# Altium schematic sheet DDMTD.SchDoc: Sayma AMC
size 420 x 297 mm; CheckedBy: P.Kulik,T.Przywozki,W.Ruclo; Author: G.Kasprowicz; CompanyName: WUT ISE; DrawnBy: G.Kasprowicz; Organization: WUT ISE; Address1: PW ISE; Address2: Nowowiejska 15/19 00-665 Warsaw; Address3: gkasprow@gmail.com; DocumentNumber: 18; Revision: 2; SheetNumber: 18; SheetTotal: 32; ModifiedBy: -; CheckedDate: -; Title2: WR DDMTD; DivGrp: WUT ISE; Designer: G.Kasprowicz; ModifiedDate: -; ProjectName: Sensor Box
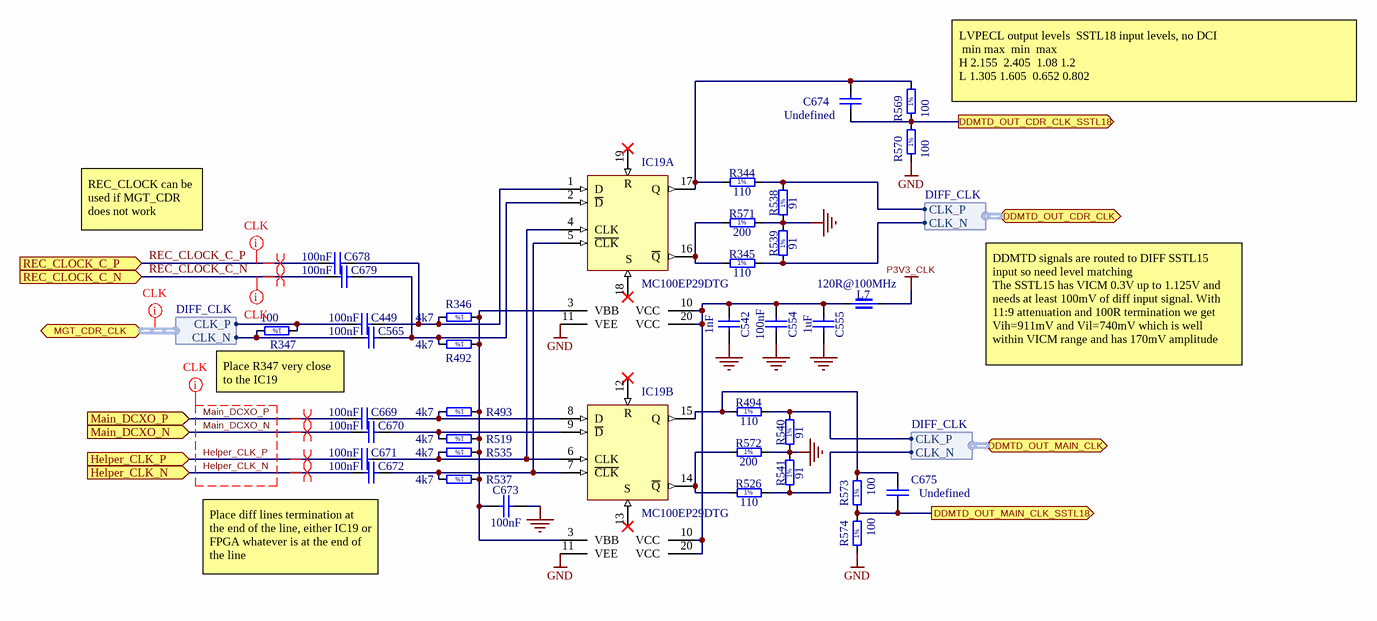
[diagram p0: DDMTD.SchDoc]

## Parts
C449  100nF  [CAPC1005X55N]
C542  1nF  [CAPC0603X33N]
C554  100nF  [CAPC0603X33N]
C555  1uF  [CAPC1005X55N]
C565  100nF  [CAPC1005X55N]
C669  100nF  [CAPC1005X55N]
C670  100nF  [CAPC1005X55N]
C671  100nF  [CAPC1005X55N]
C672  100nF  [CAPC1005X55N]
C673  100nF  [CAPC0603X33N]
C674  Undefined  [CAPC1005X55N]
C675  Undefined  [CAPC1005X55N]
C678  100nF  [CAPC1005X55N]
C679  100nF  [CAPC1005X55N]
IC19  MC100EP29DTG  [SOP65P640X120-20N]  (parts A,B of 2)
L7  120R@100MHz  [INDC1608X95N]
R344  110  [RESC1005X40N]
R345  110  [RESC1005X40N]
R346  4k7  [RESC1005X40N]
R347  100  [RESC1005X40N]
R492  4k7  [RESC1005X40N]
R493  4k7  [RESC1005X40N]
R494  110  [RESC1005X40N]
R519  4k7  [RESC1005X40N]
R526  110  [RESC1005X40N]
R535  4k7  [RESC1005X40N]
R537  4k7  [RESC1005X40N]
R538  91  [RESC1005X40N]
R539  91  [RESC1005X40N]
R540  91  [RESC1005X40N]
R541  91  [RESC1005X40N]
R569  100  [RESC1005X40N]
R570  100  [RESC1005X40N]
R571  200  [RESC1005X40N]
R572  200  [RESC1005X40N]
R573  100  [RESC1005X40N]
R574  100  [RESC1005X40N]

## Ports
DDMTD_OUT_CDR_CLK (bidir, harness DIFF_CLK), DDMTD_OUT_CDR_CLK_SSTL18 (out), DDMTD_OUT_MAIN_CLK (bidir, harness DIFF_CLK), DDMTD_OUT_MAIN_CLK_SSTL18 (out), Helper_CLK_N (in), Helper_CLK_P (in), Main_DCXO_N (in), Main_DCXO_P (in), MGT_CDR_CLK (bidir, harness DIFF_CLK), REC_CLOCK_C_N (in), REC_CLOCK_C_P (in)

## Harnesses
DIFF_CLK: CLK_N, CLK_P

## Nets
GND: C542.1 C554.1 C555.2 C673.1 IC19.11(VEE) R538.1 R539.2 R540.1 R541.2 R570.1 R571.2 R572.2 R574.1
P3V3_CLK: L7.1
DDMTD_OUT_CDR_CLK_SSTL18: C674.1 R569.1 R570.2 ; port DDMTD_OUT_CDR_CLK_SSTL18
DDMTD_OUT_MAIN_CLK_SSTL18: C675.1 R573.1 R574.2 ; port DDMTD_OUT_MAIN_CLK_SSTL18
Helper_CLK_N: C672.1 ; port Helper_CLK_N
Helper_CLK_P: C671.1 ; port Helper_CLK_P
Main_DCXO_N: C670.1 ; port Main_DCXO_N
Main_DCXO_P: C669.1 ; port Main_DCXO_P
REC_CLOCK_C_N: C679.1 ; port REC_CLOCK_C_N
REC_CLOCK_C_P: C678.1 ; port REC_CLOCK_C_P
NetC449_1: C449.1 R347.1 ; port MGT_CDR_CLK.CLK_P
NetC449_2: C449.2 C678.2 IC19.1(D) R346.2
NetC542_2: C542.2 C554.2 C555.1 IC19.10(VCC) IC19.20(VCC) L7.2
NetC565_1: C565.1 R347.2 ; port MGT_CDR_CLK.CLK_N
NetC565_2: C565.2 C679.2 IC19.2(~{D}) R492.2
NetC669_2: C669.2 IC19.8(D) R493.2
NetC670_2: C670.2 IC19.9(~{D}) R519.2
NetC671_2: C671.2 IC19.4(CLK) IC19.6(CLK) R535.2
NetC672_2: C672.2 IC19.5(~{CLK}) IC19.7(~{CLK}) R537.2
NetC673_2: C673.2 IC19.3(VBB) R346.1 R492.1 R493.1 R519.1 R535.1 R537.1
NetC674_2: C674.2 IC19.17(Q) R344.1 R569.2
NetC675_2: C675.2 IC19.15(Q) R494.1 R573.2
NetIC19_14: IC19.14(~{Q}) R526.1 R572.1
NetIC19_16: IC19.16(~{Q}) R345.1 R571.1
NetR344_2: R344.2 R538.2 ; port DDMTD_OUT_CDR_CLK.CLK_P
NetR345_2: R345.2 R539.1 ; port DDMTD_OUT_CDR_CLK.CLK_N
NetR494_2: R494.2 R540.2 ; port DDMTD_OUT_MAIN_CLK.CLK_P
NetR526_2: R526.2 R541.1 ; port DDMTD_OUT_MAIN_CLK.CLK_N

Not connected (* = marked no-connect by the designer): IC19 12(R)* 13(S)* 18(S)* 19(R)*

## Layout directives
differential pair: Helper_CLK_N, Helper_CLK_P, Main_DCXO_N, Main_DCXO_P, REC_CLOCK_C_N, REC_CLOCK_C_P
net class CLK: (no net found under the mark), Helper_CLK_N, Helper_CLK_P, Main_DCXO_N, Main_DCXO_P, REC_CLOCK_C_N, REC_CLOCK_C_P

## Notes on the sheet
- LVPECL output levels		SSTL18 input levels, no DCI
  min	max		min	 max
  H	2.155 	2.405		1.08	1.2
  L	1.305	1.605		0.652	0.802
- REC_CLOCK can be used if MGT_CDR does not work
- DDMTD signals are routed to DIFF SSTL15 input so need level matching
  The SSTL15 has VICM 0.3V up to 1.125V and needs at least 100mV of diff input signal. With 11:9 attenuation and 100R termination we get Vih=911mV and Vil=740mV which is well within VICM range and has 170mV amplitude
- Place R347 very close  to the IC19
- Place diff lines termination at the end of the line, either IC19 or FPGA whatever is at the end of the line
- Project/Equipment
- Document
- Designer
- Drawn by
- Check.by
- Copyright WUT ISE 2018.
  This documentation describes Open Hardware and is licensed under the CERN OHL v.1.1. You may redistribute and modify this documentation under the terms of the CERN OHL v.1.1. (http://ohwr.org/CERNOHL). This documentation is distributed WITHOUT ANY EXPRESS OR IMPLIED WARRANTY, INCLUDING OF MERCHANTABILITY, SATISFACTORY QUALITY AND FITNESS FOR A PARTICULAR PURPOSE. Please see the CERN OHL v.1.1 for applicable conditions.
- Contact
- File
- Last Mod.
- Print Date
- Sheet
- Size
- A3
- of
- Rev
- (in symbol R0402_4K7_1%_0.0625W_100PPM) 1%
- (in symbol R0402_91R_1%_0.0625W_100PPM) 1%
- (in symbol R0402_100R_1%_0.0625W_100PPM) 1%
- (in symbol R0402_110R_1%_0.0625W_100PPM) 1%
- (in symbol R0402_200R_1%_0.0625W_100PPM) 1%

## Library data of the parts
C449 C565 C669-C672 C678 C679 = CC0402_100NF_16V_10%_X5R: Non-polarised capacitor; Manufacturer: GENERIC; Manufacturer1 Part Number: GRM155R61C104KA88D; Part Description: SMD Multilayer Chip Ceramic Capacitor; TC: X5R; Tolerance: ±10%; Voltage: 16V; Case: 0402; Manufacturer Part Number: CC0402_100NF_16V_10%_X5R; Manufacturer1 Example: MURATA; Part Number: CC0402_100NF_16V_10%_X5R; Pin Count: 2; SMD: Yes; Status: None; Value: 100nF; Component Kind: Standard; Component Type: Standard; Mounted: Yes; Socket: No; Sense: No; Manufacturer1 ComponentHeight: 0.55mm; HelpURL: \\cern.ch\dfs\Applications\Altium\Datasheets\CC0402_X5R_MURATA_GRM.pdf; Author: CERN DEM JLC; CreateDate: 10.12.2013; LatestRevisionDate: 10.12.2013
C542 = CC0201_1NF_16V_10%_X5R: Non-polarised capacitor; Manufacturer: GENERIC; Part Description: SMD Multilayer Chip Ceramic Capacitor; Manufacturer1 Part Number: 0201YD102KAT2A; Tolerance: ±10%; Voltage: 16V; TC: X5R; Manufacturer Part Number: CC0201_1NF_16V_10%_X5R; Part Number: CC0201_1NF_16V_10%_X5R; Value: 1nF; Component Kind: Standard; Component Type: Standard; Pin Count: 2; Status: Not Recommended; Case: 0201; Mounted: Yes; Socket: No; SMD: Yes; Sense: No; Manufacturer1 Example: AVX; Manufacturer1 ComponentHeight: 0.33mm; HelpURL: \\cern.ch\dfs\Applications\Altium\Datasheets\CC0201_X5R_AVX.pdf; Author: CERN DEM JLC; CreateDate: 03.12.2007; LatestRevisionDate: 03.12.2007
C554 C673 = CC0201_100NF_6.3V_10%_X5R: Non-polarised capacitor; Manufacturer: GENERIC; Part Description: SMD Multilayer Chip Ceramic Capacitor; Manufacturer1 Part Number: 02016D104KAT2A; Tolerance: ±10%; Voltage: 6.3V; TC: X5R; Manufacturer Part Number: CC0201_100NF_6.3V_10%_X5R; Part Number: CC0201_100NF_6.3V_10%_X5R; Value: 100nF; Component Kind: Standard; Component Type: Standard; Pin Count: 2; Status: Not Recommended; Case: 0201; Mounted: Yes; Socket: No; SMD: Yes; Sense: No; Manufacturer1 Example: AVX; Manufacturer1 ComponentHeight: 0.33mm; HelpURL: \\cern.ch\dfs\Applications\Altium\Datasheets\CC0201_X5R_AVX.pdf; Author: CERN DEM JLC; CreateDate: 03.12.2007; LatestRevisionDate: 03.12.2007
C555 = CC0402_1UF_16V_10%_X5R: Non-polarised capacitor; Manufacturer: GENERIC; Part Description: SMD Multilayer Chip Ceramic Capacitor; Manufacturer1 Part Number: C1005X5R1C105KT; Tolerance: ±10%; Voltage: 16V; TC: X5R; Manufacturer Part Number: CC0402_1UF_16V_10%_X5R; Part Number: CC0402_1UF_16V_10%_X5R; Value: 1uF; Component Kind: Standard; Component Type: Standard; Pin Count: 2; Status: Preferred; Case: 0402; Mounted: Yes; Socket: No; SMD: Yes; Sense: No; Manufacturer1 Example: TDK; Manufacturer1 ComponentHeight: 0.55mm; HelpURL: \\cern.ch\dfs\Applications\Altium\Datasheets\CC0402_X5R_TDK_C.pdf; Author: CERN DEM JLC; CreateDate: 25.10.2012; LatestRevisionDate: 25.10.2012
C674 C675 = CC0402_NO-VALUE: Non-polarised capacitor; Part Description: Reserved Footprint For 0402(1005) Chip Ceramic Capacitor; Mounted: No; Part Number: CC0402_NO-VALUE; Component Kind: Standard; Component Type: Standard; Pin Count: 2; Value: Undefined; Status: None; Manufacturer: Undefined; Manufacturer Part Number: CC0402_NO-VALUE; Case: 0402; Socket: No; SMD: Yes; Sense: No; Manufacturer1 ComponentHeight: 0.55mm; HelpURL: Undefined; Author: CERN DEM JLC; CreateDate: 14.01.2014; LatestRevisionDate: 14.01.2014
IC19 = MC100EP29DTG: 3.3V/5V ECL Dual Differential Data and Clock D Flip-Flop With Set and Reset; Manufacturer: ON SEMICONDUCTOR; PressFit: No; Bonding: No; Part Number: MC100EP29DTG; Component Kind: Standard; Component Type: Standard; Device: MC100EP29DTG; PackageDescription: SOP, 20-Leads, Body 6.5x4.4mm, Pitch 0.65mm, IPC Medium Density; Part Description: 3.3V/5V ECL Dual Differential Data And Clock D Flip-Flop With Set and Reset; Manufacturer Part Number: MC100EP29DTG; Pin Count: 20; Case: TSSOP20; Mounted: Yes; Socket: No; SMD: Yes; Sense: No; ComponentHeight: 1.2mm; Author: CERN DEM JLC; HelpURL: \\cern.ch\dfs\Applications\Altium\Datasheets\MC100EP29DTG.pdf; CreateDate: 12.01.2011; LatestRevisionDate: 12.01.2011
L7 = IND0603_MURATA_BLM18PG121SN1D: Manufacturer: MURATA; Part Description: SMD EMIFIL Chip Ferrite Bead; Power: 2A; Resistance: 0.05R; Manufacturer Part Number: BLM18PG121SN1D; Part Number: IND0603_MURATA_BLM18PG121SN1D; Value: 120R@100MHz; Component Kind: Standard; Component Type: Standard; Pin Count: 2; Status: None; Case: 0603; Mounted: Yes; Socket: No; SMD: Yes; Sense: No; ComponentHeight: 0.95mm; HelpURL: \\cern.ch\dfs\Applications\Altium\Datasheets\IND0603_MURATA_BLM18P.pdf; Author: CERN DEM BC; CreateDate: 27.07.2015; LatestRevisionDate: 25.10.2018
R344 R345 R494 R526 = R0402_110R_1%_0.0625W_100PPM: Resistor - 1%; Manufacturer: GENERIC; Part Description: General Purpose Thick Film Chip Resistor; Manufacturer1 Part Number: 232270671101L; TC: ±100ppm/°C; PressFit: No; Manufacturer Part Number: R0402_110R_1%_0.0625W_100PPM; Part Number: R0402_110R_1%_0.0625W_100PPM; Tolerance: ±1%; Value: 110; Component Kind: Standard; Component Type: Standard; Pin Count: 2; Status: Not Recommended; Power: 0.0625W; Case: 0402; Mounted: Yes; Sense: No; Socket: No; SMD: Yes; Manufacturer1 Example: YAGEO PHYCOMP; Manufacturer1 ComponentHeight: 0.4mm; HelpURL: \\cern.ch\dfs\Applications\Altium\Datasheets\R0402_Phycomp_RC0402.pdf; Author: CERN DEM JLC; CreateDate: 03.12.2007; LatestRevisionDate: 17.10.2012
R346 R492 R493 R519 R535 R537 = R0402_4K7_1%_0.0625W_100PPM: Resistor - 1%; Manufacturer: GENERIC; Part Description: General Purpose Thick Film Chip Resistor; Manufacturer1 Part Number: 232270674702L; TC: ±100ppm/°C; PressFit: No; Manufacturer Part Number: R0402_4K7_1%_0.0625W_100PPM; Part Number: R0402_4K7_1%_0.0625W_100PPM; Tolerance: ±1%; Value: 4k7; Component Kind: Standard; Component Type: Standard; Pin Count: 2; Status: Not Recommended; Power: 0.0625W; Case: 0402; Mounted: Yes; Sense: No; Socket: No; SMD: Yes; Manufacturer1 Example: YAGEO PHYCOMP; Manufacturer1 ComponentHeight: 0.4mm; HelpURL: \\cern.ch\dfs\Applications\Altium\Datasheets\R0402_Phycomp_RC0402.pdf; Author: CERN DEM JLC; CreateDate: 03.12.2007; LatestRevisionDate: 17.10.2012
R347 R569 R570 R573 R574 = R0402_100R_1%_0.0625W_100PPM: Resistor - 1%; Manufacturer: GENERIC; Part Description: General Purpose Thick Film Chip Resistor; Manufacturer1 Part Number: 232270671001L; TC: ±100ppm/°C; PressFit: No; Manufacturer Part Number: R0402_100R_1%_0.0625W_100PPM; Part Number: R0402_100R_1%_0.0625W_100PPM; Tolerance: ±1%; Value: 100; Component Kind: Standard; Component Type: Standard; Pin Count: 2; Status: Not Recommended; Power: 0.0625W; Case: 0402; Mounted: Yes; Sense: No; Socket: No; SMD: Yes; Manufacturer1 Example: YAGEO PHYCOMP; Manufacturer1 ComponentHeight: 0.4mm; HelpURL: \\cern.ch\dfs\Applications\Altium\Datasheets\R0402_Phycomp_RC0402.pdf; Author: CERN DEM JLC; CreateDate: 03.12.2007; LatestRevisionDate: 17.10.2012
R538-R541 = R0402_91R_1%_0.0625W_100PPM: Resistor - 1%; Manufacturer: GENERIC; Part Description: General Purpose Thick Film Chip Resistor; Manufacturer1 Part Number: 232270679109L; TC: ±100ppm/°C; PressFit: No; Manufacturer Part Number: R0402_91R_1%_0.0625W_100PPM; Part Number: R0402_91R_1%_0.0625W_100PPM; Tolerance: ±1%; Value: 91; Component Kind: Standard; Component Type: Standard; Pin Count: 2; Status: Not Recommended; Power: 0.0625W; Case: 0402; Mounted: Yes; Sense: No; Socket: No; SMD: Yes; Manufacturer1 Example: YAGEO PHYCOMP; Manufacturer1 ComponentHeight: 0.4mm; HelpURL: \\cern.ch\dfs\Applications\Altium\Datasheets\R0402_Phycomp_RC0402.pdf; Author: CERN DEM JLC; CreateDate: 03.12.2007; LatestRevisionDate: 17.10.2012
R571 R572 = R0402_200R_1%_0.0625W_100PPM: Resistor - 1%; Part Description: General Purpose Thick Film Chip Resistor; Manufacturer: GENERIC; Manufacturer1 Part Number: 232270672001L; TC: ±100ppm/°C; PressFit: No; Part Number: R0402_200R_1%_0.0625W_100PPM; Component Kind: Standard; Component Type: Standard; Pin Count: 2; Value: 200; Status: Not Recommended; Power: 0.0625W; Tolerance: ±1%; Manufacturer Part Number: R0402_200R_1%_0.0625W_100PPM; Case: 0402; Mounted: Yes; Sense: No; Socket: No; SMD: Yes; Manufacturer1 Example: YAGEO PHYCOMP; Manufacturer1 ComponentHeight: 0.4mm; HelpURL: \\cern.ch\dfs\Applications\Altium\Datasheets\R0402_Phycomp_RC0402.pdf; Author: CERN DEM JLC; CreateDate: 03.12.2007; LatestRevisionDate: 17.10.2012